# Altium schematic sheet Auxilliary Transformer.SchDoc
size A
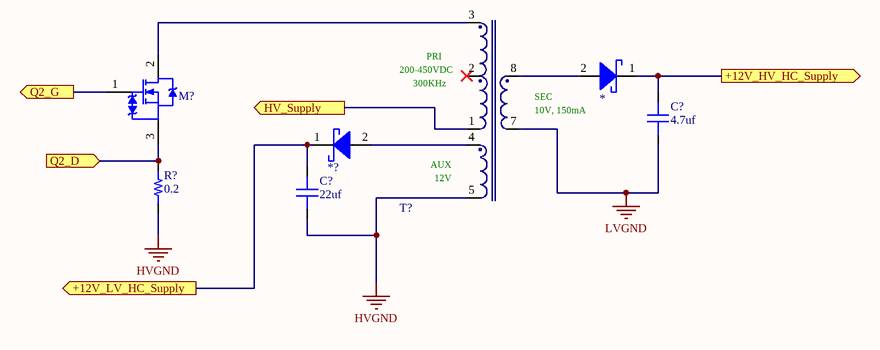
[diagram p0: Auxilliary Transformer.SchDoc]

## Parts
(Parts that share a designator on the sheet are numbered #1, #2 ... from top to bottom, then left to right.)
*  BAT46WJ  [SOD323F]  (value not drawn)
*?  BAT46WJ  [SOD323F]  (value not drawn)
C?#1  value 4.7uf  [CAP 0805/2012]  (hidden comment: Capacitor MLCC 4.7uf 25V CAP 0805/2012)
C?#2  value 22uf  [CAP 1210/3225 - 1.6MM]  (hidden comment: Capacitor MLCC 22uf 50V CAP 1210/3225)
M?  AUX Transistor  [PG-SOT223]  (value not drawn)
R?  value 0.2  [RES 0805/2012]  (hidden comment: Resistor 0.2 0805 1/10W 1%)
T?  Aux Transformer  [750817020]  (value not drawn)

## Ports
+12V_HV_HC_Supply (out), +12V_LV_HC_Supply (out), HV_Supply (out), Q2_D (in), Q2_G (out)

## Nets
HVGND: C?#2.1 R?.1 T?.5
LVGND: C?#1.1 T?.7
+12V_HV_HC_Supply: *.1(K) C?#1.2 ; port +12V_HV_HC_Supply
+12V_LV_HC_Supply: *?.1(K) C?#2.2 ; port +12V_LV_HC_Supply
HV_Supply: T?.1 ; port HV_Supply
Q2_D: M?.3(S) R?.2 ; port Q2_D
Q2_G: M?.1(G) ; port Q2_G
Net*?_2: *?.2(A) T?.4
Net*_2: *.2(A) T?.8
NetM?_2: M?.2(D) T?.3

Not connected (* = marked no-connect by the designer): T? 2*

## Notes on the sheet
- (in symbol 1) PRI; 300KHz; SEC; 10V, 150mA; AUX; 12V

## Library data of the parts
* *? = 16: Diode Schottky 100V 250mA (DC) Surface Mount SOD-323F; Manufacturer_id: 1; MfrPartNo: BAT46WJ,115; idDiode: 16; Value: Vf=0.3@20mA; Power: 100Vr; Created_By: Nick Mah; Drawer_id: 1; Name: BAT46WJ; Type: Schottky; Num_Circuits: 1; Ic: 250mA; Package: SOD-323F; Link: https://www.digikey.com/product-detail/en/nexperia-usa-inc/BAT46WJ115/1727-4817-1-ND/2531304; ComponentLink1Description: Datasheet; ComponentLink1URL: https://assets.nexperia.com/documents/data-sheet/BAT46WJ.pdf; Supplier1: Digi-Key; Supplier1PartNo: 1727-4817-1-ND
C?#1 = 713: Manufacturer_id: 1; idCapacitor: 713; Name: Cap_4.7uf_25V_CAP 0805/2012; Dielectric: Ceramic; Created_By: Nick Mah; Drawer_id: 1; Voltage_Rating: 25V; Package: CAP 0805/2012; Created_Date: 10/20/2018
C?#2 = 1084: Manufacturer_id: 1; idCapacitor: 1084; Name: Cap_22uf_50V_CAP 1210/3225; Dielectric: Ceramic; Created_By: Nick Mah; Drawer_id: 1; Voltage_Rating: 50V; Package: CAP 1210/3225; ComponentLink1Description: Datasheet
M? = 14: COOLMOS P7 800V SOT-223; MfrPartNo: IPN80R750P7ATMA1; Manufacturer_id: 1; idFETs: 14; Value: N_Channel; Id: 7A; Rds_On: 750mOhm; Vgs(typ): 10V; Vgs(Max): 20V; Power(Max): 7.2W; Created_By: Nick Mah; Drawer_id: 1; Name: IPN80R750P7; Vdss: 800V; Num_Circuits: 1; Package: PG-SOT223; Link: https://www.digikey.com/product-detail/en/infineon-technologies/IPN80R750P7ATMA1/IPN80R750P7ATMA1TR-ND/8130852; ComponentLink1Description: Datasheet; ComponentLink1URL: https://www.infineon.com/dgdl/Infineon-IPN80R750P7-DS-v02_00-EN.pdf?fileId=5546d4625f2e26bc015f528bca636b84; Supplier1: Digi-Key; Supplier1PartNo: IPN80R750P7ATMA1TR-ND
R? = 2709: Manufacturer_id: 1; idResistor: 2709; Name: Res_0.2_0805_1/10W_1%; Created_By: Nick Mah; Supplier 1: Digi-Key; Supplier Part Number 1: Digi-Key; Drawer_id: 1; Tolerance: 1%; Power: 1/10W; Package: 0805; ComponentLink1Description: Datasheet
T? = 1: Auxilliary Transformer for DC-DC Senior Project; idTransformer: 1; Name: 500W DC-DC Aux Trfrmr; Value: 4mH - 9.33:1:1.17; Current_Rating: 100mA; Tolerance: 10%; Voltage_Primary: 200-450VDC; Voltage_Secondary: 10VDC; Manufacturer_id: 1; Drawer_id: 1; Package: Through Hole; MfrPartNo: 750817020; Link: https://katalog.we-online.com/en/ctm/MID-OLLT/S/750817020?m=n&sq=750817020&sp=https%3A%2F%2Fwww.we-online.com%2Fweb%2Fen%2Fwuerth_elektronik%2Fsearchpage.php%3Fsearch%3D750817020#vs_ct:1; ComponentLink1Description: Datasheet; ComponentLink1URL: https://katalog.we-online.com/ctm/datasheet/750817020.pdf